# EAGLE design cpu-module (EAGLE 6.4)
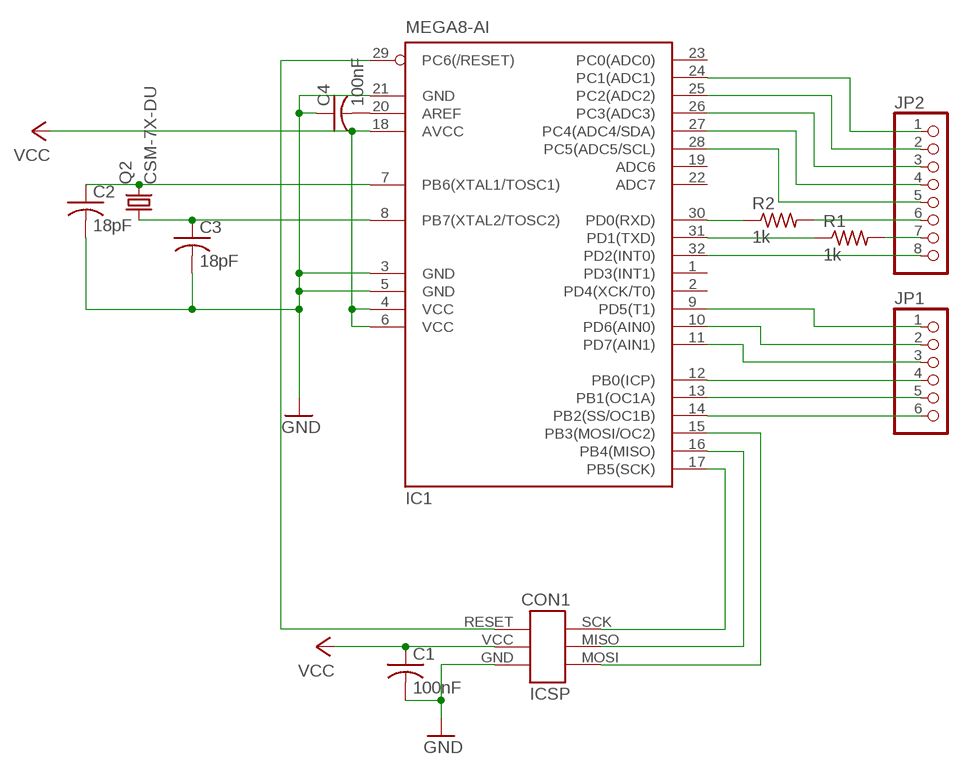
[diagram p0: schematic, sheet 1]

## Parts
C1  100nF  C-USC0603K  [C0603K]
C2  18pF  C-USC0805  [C0805]
C3  18pF  C-USC0805  [C0805]
C4  100nF  C-USC0603K  [C0603K]
CON1  ICSP-HEADER  [ICSP-HEADER]
IC1  MEGA8-AI  [TQFP32-08]
JP1  PINHD-1X6B  [1X06-BIG]
JP2  PINHD-1X8BIG  [1X08-BIG]
Q2  CSM-7X-DU  [CSM-7X-DU]
R1  1k  R-US_R0603  [R0603]
R2  1k  R-US_R0603  [R0603]

## Nets
GND: C1.2 C2.2 C3.2 C4.1 CON1.GND IC1.3(GND) IC1.5(GND) IC1.21(GND)
N$1: C2.1 IC1.7(PB6(XTAL1/TOSC1)) Q2.2
N$2: C3.1 IC1.8(PB7(XTAL2/TOSC2)) Q2.1
N$3: C4.2 IC1.20(AREF)
N$4: CON1.SCK IC1.17(PB5(SCK))
N$5: CON1.MISO IC1.16(PB4(MISO))
N$6: CON1.MOSI IC1.15(PB3(MOSI/OC2))
N$7: IC1.30(PD0(RXD)) R2.1
N$8: JP2.7 R1.2
N$9: IC1.31(PD1(TXD)) R1.1
N$10: IC1.32(PD2(INT0)) JP2.8
N$11: IC1.24(PC1(ADC1)) JP2.1
N$12: CON1.RESET IC1.29(PC6(/RESET))
N$13: IC1.25(PC2(ADC2)) JP2.2
N$14: IC1.26(PC3(ADC3)) JP2.3
N$15: IC1.27(PC4(ADC4/SDA)) JP2.4
N$16: IC1.28(PC5(ADC5/SCL)) JP2.5
N$17: IC1.14(PB2(SS/OC1B)) JP1.6
N$18: IC1.13(PB1(OC1A)) JP1.5
N$19: IC1.12(PB0(ICP)) JP1.4
N$20: IC1.11(PD7(AIN1)) JP1.3
N$21: IC1.10(PD6(AIN0)) JP1.2
N$22: IC1.9(PD5(T1)) JP1.1
N$23: JP2.6 R2.2
VCC: C1.1 CON1.VCC(+5V) IC1.4(VCC) IC1.6(VCC) IC1.18(AVCC)
Unconnected: IC1.1(PD3(INT1)) IC1.2(PD4(XCK/T0)) IC1.19(ADC6) IC1.22(ADC7) IC1.23(PC0(ADC0))

## Library data of the parts
C1-C4 = adafruit:C-US: CAPACITOR, American symbol
CON1 = serge:ICSP-HEADER
IC1 = atmel:MEGA8: MICROCONTROLLER 8 Kbytes FLASH, 1 kbytes SRAM, 512 bytes EEPROM, USART, 6-channel 10 bit ADC, 2-channel 8 bit ADC Pin compatible with Atmega48, ATMega88, ATMega168 Source: avr.lbr; MPN: ATMEGA8-16AU; OC_FARNELL: 9171371; OC_NEWARK: 73M8863
JP1 = adafruit:PINHD-1X6: PIN HEADER
JP2 = adafruit:PINHD-1X8: PIN HEADER
Q2 = crystal:CSM-7X-DU: SMD CRYSTAL Source: www.ecsxtal.com .. Crystal 3.6864MHz CSM_7X_DU.PDF; OC_FARNELL: unknown; OC_NEWARK: unknown
R1 R2 = adafruit:R-US_: RESISTOR, American symbol

## Board
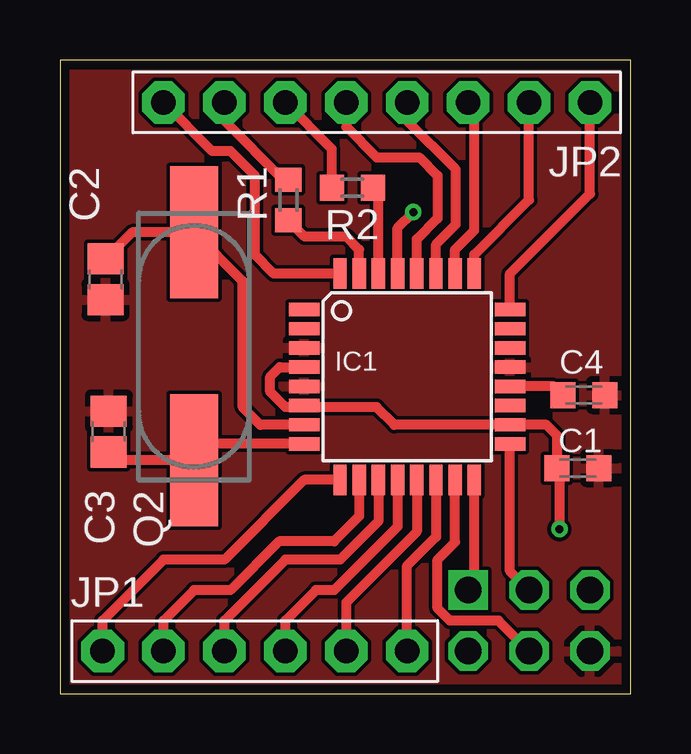
[diagram p1: board, top side]
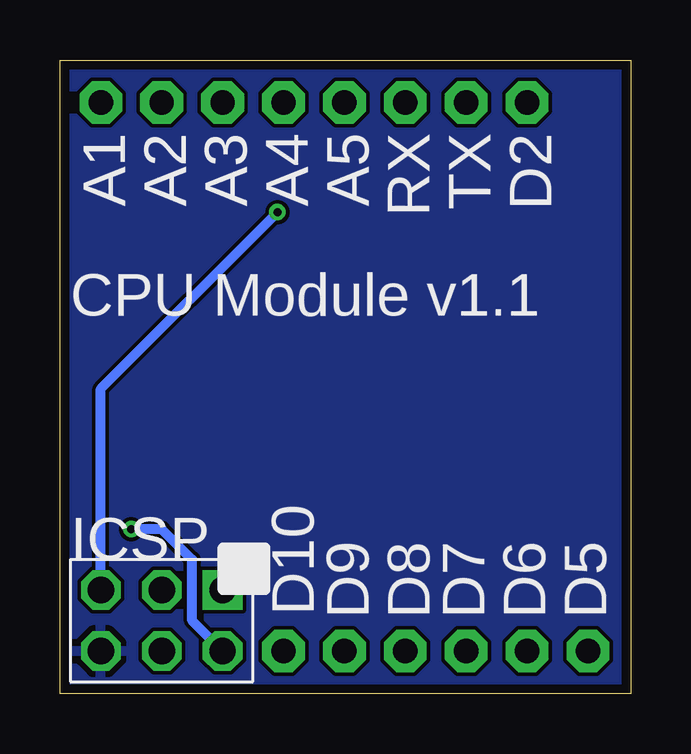
[diagram p2: board, bottom side, seen from below]

Size 23.8 x 26.41 mm. Coordinates in mm from the lower left corner, seen from the top.
Outline: 0,0 23.8,0 23.8,26.41 0,26.41 0,0
Copper layers (1*16): Top 0.0356mm / dielectric 1.5011mm / Bottom 0.0356mm
Design rules "LaenPCBOrder": minimum track width 6mil, minimum drill 13mil, track to track 6mil, track to pad 6mil, pad to pad 6mil, via to via 6mil, smd to smd 6mil, copper to edge 15mil, drill to drill 6mil, minimum pad ring 7mil, minimum via ring 7mil, stop-mask expansion 4mil, vias tented up to drill 0mil, thermal gap 10mil

### Footprints (pad centres in the part's own frame; a part is rotated, then mirrored left to right if it is on the bottom)
C0603K = smd 1.05 x 1.08: 1 -0.875,0; 2 0.875,0
C0805 = smd 1.3 x 1.5: 1 -0.85,0; 2 0.85,0
ICSP-HEADER = drill 1.1 octagon: GND 1.27,-3.81; MOSI 1.27,-1.27; RESET -1.27,-3.81; SCK -1.27,-1.27; VCC 1.27,1.27 | drill 1.1 square: MISO -1.27,1.27
TQFP32-08 = smd 1.27 x 0.559: 1 -4.293,2.8; 2 -4.293,2; 3 -4.293,1.2; 4 -4.293,0.4; 5 -4.293,-0.4; 6 -4.293,-1.2; 7 -4.293,-2; 8 -4.293,-2.8; 17 4.293,-2.8; 18 4.293,-2; 19 4.293,-1.2; 20 4.293,-0.4; 21 4.293,0.4; 22 4.293,1.2; 23 4.293,2; 24 4.293,2.8 | smd 0.559 x 1.27: 9 -2.8,-4.293; 10 -2,-4.293; 11 -1.2,-4.293; 12 -0.4,-4.293; 13 0.4,-4.293; 14 1.2,-4.293; 15 2,-4.293; 16 2.8,-4.293; 25 2.8,4.293; 26 2,4.293; 27 1.2,4.293; 28 0.4,4.293; 29 -0.4,4.293; 30 -1.2,4.293; 31 -2,4.293; 32 -2.8,4.293
1X06-BIG = drill 1.016 pad 1.778 octagon: 1 -6.35,0; 2 -3.81,0; 3 -1.27,0; 4 1.27,0; 5 3.81,0; 6 6.35,0
1X08-BIG = drill 1.016 pad 1.778 octagon: 1 -8.89,0; 2 -6.35,0; 3 -3.81,0; 4 -1.27,0; 5 1.27,0; 6 3.81,0; 7 6.35,0; 8 8.89,0
CSM-7X-DU = smd 5.5 x 2: 1 -4.75,0; 2 4.75,0
R0603 = smd 1 x 1.1: 1 -0.85,0; 2 0.85,0

### Placement (x,y rotation side)
C1  21.59,9.4 0 top
C2  1.91,17.27 270 top
C3  2.03,10.92 90 top
C4  21.84,12.45 180 top
CON1  18.29,3.05 270 bottom
IC1  14.48,13.21 0 top
JP1  8.13,1.78 0 top
JP2  13.21,24.64 180 top
Q2  5.59,14.48 90 top
R1  9.53,20.57 90 top
R2  12.19,21.08 180 top

### Tracks (layer width: path | path; a pad name or v marks a point on that pad's centre or on a via)
GND
  pour Top: 0.51,0.51 23.37,0.51 23.37,25.91 0.51,25.91
  pour Bottom: 0.51,25.91 0.51,0.51 23.37,0.51 23.37,25.91
N$1
  Top 0.406: IC1.7 8.35,11.21 7.62,11.94 7.62,17.2 Q2.2 3.01,19.23 C2.1
N$2
  Top 0.406: IC1.8 6.27,10.41 Q2.1 2.53,9.73 C3.1
N$3
  Top 0.406: C4.2 20.61,12.81 IC1.20
N$4
  Top 0.406: IC1.17 18.77,5.11 CON1.SCK
N$5
  Top 0.406: IC1.16 17.28,4.58 CON1.MISO
N$6
  Top 0.406: IC1.15 16.48,6.32 15.75,5.59 15.75,3.56 16.26,3.05 18.29,3.05 CON1.MOSI
N$7
  Top 0.406: IC1.30 13.28,20.85 R2.1
N$8
  Top 0.406: R1.2 9.31,21.42 6.86,23.88 JP2.7
N$9
  Top 0.406: IC1.31 12.48,18.51 11.94,19.05 10.2,19.05 R1.1
N$10
  Top 0.406: IC1.32 8.92,17.5 8.13,18.29 8.13,21.59 7.11,22.61 6.35,22.61 JP2.8
N$11
  Top 0.406: IC1.24 18.77,17.5 22.1,20.83 JP2.1
N$12  (via drill 0.33)
  Top 0.406: IC1.29 14.08,19.41 v14.73,20.07
  Bottom 0.406: v14.73,20.07 22.1,12.7 CON1.RESET
N$13
  Top 0.406: IC1.25 17.28,18.29 19.56,20.57 JP2.2
N$14
  Top 0.406: IC1.26 16.48,18.51 17.27,19.3 17.27,24.38 JP2.3
N$15
  Top 0.406: IC1.27 15.68,18.73 16.51,19.56 16.51,21.84 14.48,23.88 JP2.4
N$16
  Top 0.406: IC1.28 14.88,18.94 15.75,19.81 15.75,21.59 14.99,22.35 13.21,22.35 11.94,23.62 JP2.5
N$17
  Top 0.406: IC1.14 15.68,6.53 14.48,5.33 JP1.6
N$18
  Top 0.406: IC1.13 14.88,6.75 11.94,3.81 JP1.5
N$19
  Top 0.406: IC1.12 14.08,6.97 11.43,4.32 10.67,4.32 9.4,3.05 JP1.4
N$20
  Top 0.406: IC1.11 13.28,7.18 11.68,5.59 9.4,5.59 6.86,3.05 JP1.3
N$21
  Top 0.406: IC1.10 12.48,7.4 11.43,6.35 9.14,6.35 7.11,4.32 5.59,4.32 4.32,3.05 JP1.2
N$22
  Top 0.406: IC1.9 10.19,8.92 6.86,5.59 4.32,5.59 1.78,3.05 JP1.1
N$23
  Top 0.406: R2.2 11.34,22.69 JP2.6
VCC  (via drill 0.33)
  Top 0.406: IC1.4 9.16,13.61 8.76,13.21 8.76,12.57 9.4,11.94 10.12,11.94 IC1.6 10.26,11.94 13.21,11.94 13.94,11.21 IC1.18 20.29,11.21 20.72,10.78 C1.1 20.83,9.28 v20.83,6.86 20.72,6.97
  Bottom 0.406: v20.83,6.86 19.56,6.86 18.29,5.59 18.29,3.05 CON1.VCC

### Text on the board
bNames: D2 | TX | RX | A5 | A4 | A3 | A2 | A1 | CPU Module v1.1 | D10 | D5 | D6 | D7 | D8 | D9 | ICSP